# Altium schematic sheet un2bal.SchDoc
size A4
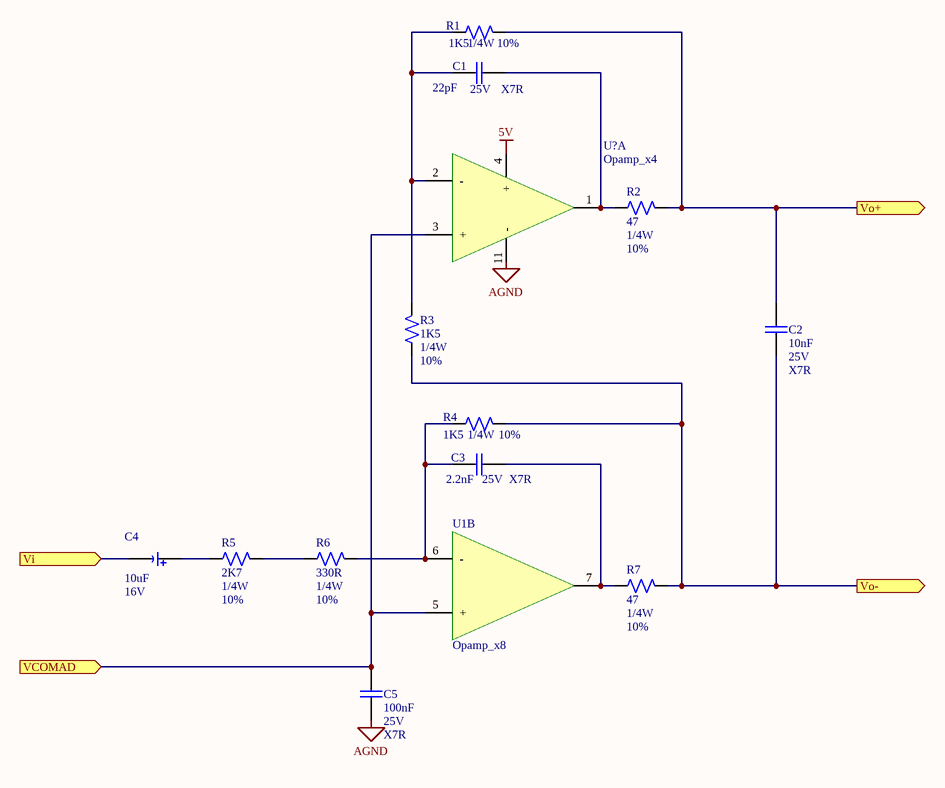
[diagram p0: un2bal.SchDoc]

## Parts
C1  valor: 22pF  tension: 25V  tolerancia: X7R  [C0805]  (hidden comment: Capacitor)
C2  valor: 10nF  tension: 25V  tolerancia: X7R  [C0805]  (hidden comment: Capacitor)
C3  valor: 2.2nF  tension: 25V  tolerancia: X7R  [C0805]  (hidden comment: Capacitor)
C4  valor: 10uF  tension: 16V  [AVX_C]  (hidden comment: Capacitor polarizado)
C5  valor: 100nF  tension: 25V  tolerancia: X7R  [C0805]  (hidden comment: Capacitor)
R1  Valor: 1K5  Potencia: 1/4W  Tolerancia: 10%  [R0603]  (hidden comment: Resistor)
R2  Valor: 47  Potencia: 1/4W  Tolerancia: 10%  [R0603]  (hidden comment: Resistor)
R3  Valor: 1K5  Potencia: 1/4W  Tolerancia: 10%  [R0603]  (hidden comment: Resistor)
R4  Valor: 1K5  Potencia: 1/4W  Tolerancia: 10%  [R0603]  (hidden comment: Resistor)
R5  Valor: 2K7  Potencia: 1/4W  Tolerancia: 10%  [R0603]  (hidden comment: Resistor)
R6  Valor: 330R  Potencia: 1/4W  Tolerancia: 10%  [R0603]  (hidden comment: Resistor)
R7  Valor: 47  Potencia: 1/4W  Tolerancia: 10%  [R0603]  (hidden comment: Resistor)
U1  Opamp_x8  [TSSOP-14]  (part B of 4)
U?  Opamp_x4  [TSSOP-14]  (part A of 4)

## Ports
VCOMAD (in), Vi (in), Vo+ (out), Vo- (out)

## Nets
5V: U?.4(+)
AGND: C5.2 U?.11(-)
VCOMAD: C5.1 U1.5(+) U?.3(+) ; port VCOMAD
Vi: C4.2 ; port Vi
Vo+: C2.1 R1.2 R2.2 ; port Vo+
Vo-: C2.2 R3.1 R4.2 R7.2 ; port Vo-
NetC1_1: C1.1 R2.1 U?.1(OUT)
NetC1_2: C1.2 R1.1 R3.2 U?.2(-)
NetC3_1: C3.1 R7.1 U1.7(OUT)
NetC3_2: C3.2 R4.1 R6.2 U1.6(-)
NetC4_1: C4.1 R5.1
NetR5_2: R5.2 R6.1

## Library data of the parts
C1-C3 C5 = Capacitor: Capacitor de placas paralelas; Encapsulado: 0805
R1-R7 = Resistor: Resistencia
U1 = Opamp_x8: Integrado con 8 operacionales
U? = Opamp_x4: Integrado con 4 operacionales